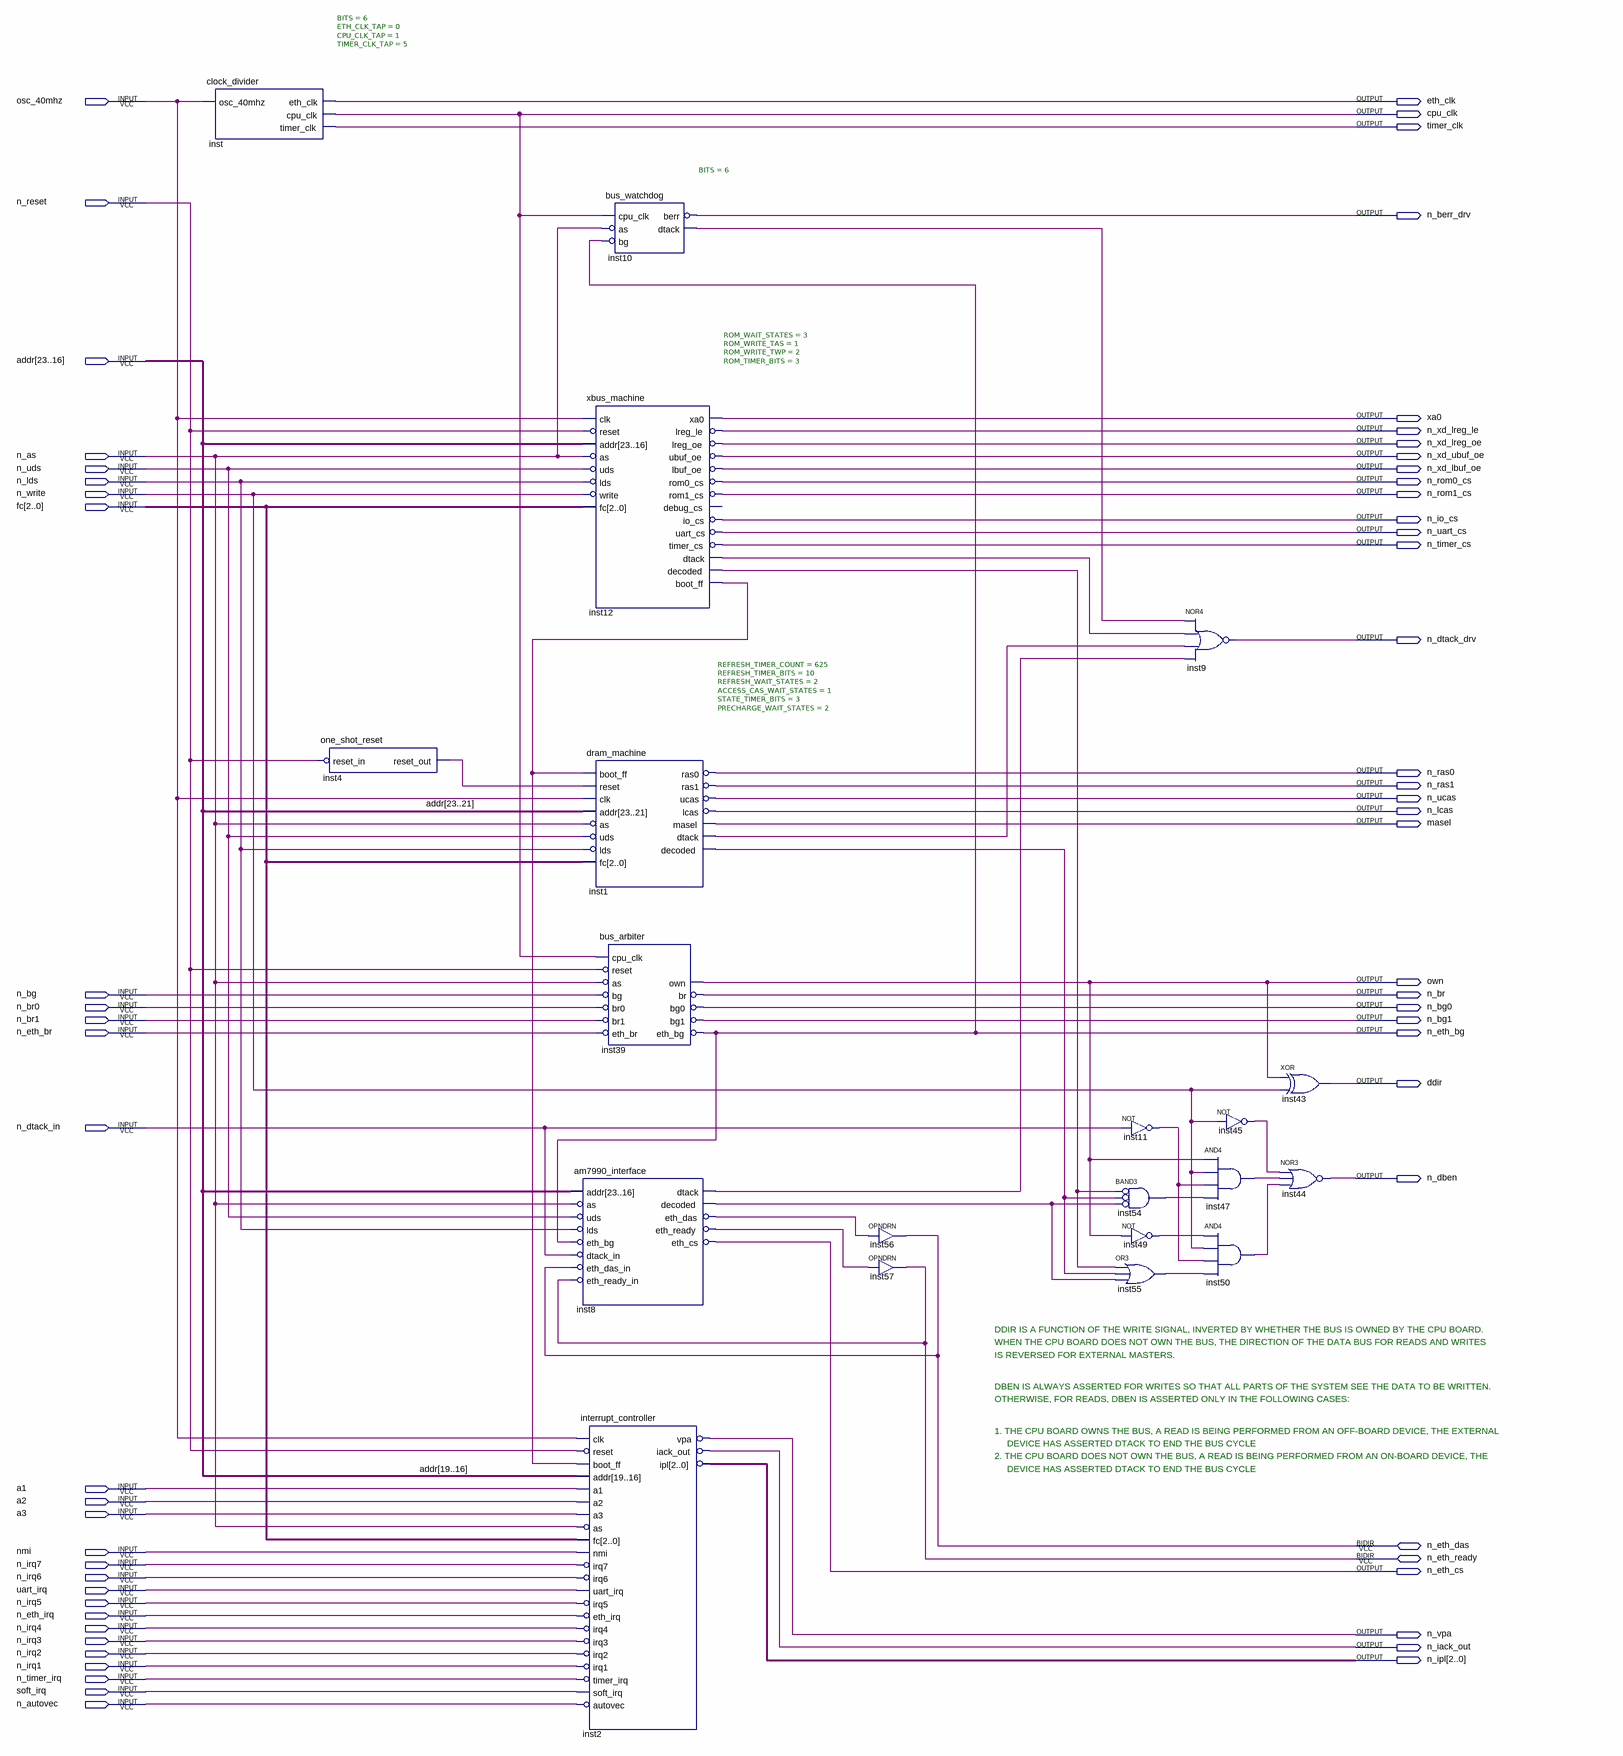
[diagram p0: schematic sheet]
// Quartus schematic COMET68k_CPLD.bdf as structural Verilog: 20 symbols, 62 pins
module COMET68k_CPLD (
  input  osc_40mhz,
  input  n_reset,
  input  [23:16] addr,
  input  n_as,
  input  n_uds,
  input  n_lds,
  input  n_write,
  input  [2:0] fc,
  input  n_bg,
  input  n_br0,
  input  n_br1,
  input  n_eth_br,
  input  n_dtack_in,
  input  a1,
  input  a2,
  input  a3,
  input  nmi,
  input  n_irq7,
  input  n_irq6,
  input  uart_irq,
  input  n_irq5,
  input  n_eth_irq,
  input  n_irq4,
  input  n_irq3,
  input  n_irq2,
  input  n_irq1,
  input  n_timer_irq,
  input  soft_irq,
  input  n_autovec,
  inout  n_eth_das,
  inout  n_eth_ready,
  output eth_clk,
  output cpu_clk,
  output timer_clk,
  output n_berr_drv,
  output xa0,
  output n_xd_lreg_le,
  output n_xd_lreg_oe,
  output n_xd_ubuf_oe,
  output n_xd_lbuf_oe,
  output n_rom0_cs,
  output n_rom1_cs,
  output n_io_cs,
  output n_uart_cs,
  output n_timer_cs,
  output n_dtack_drv,
  output n_ras0,
  output n_ras1,
  output n_ucas,
  output n_lcas,
  output masel,
  output own,
  output n_br,
  output n_bg0,
  output n_bg1,
  output n_eth_bg,
  output ddir,
  output n_dben,
  output n_eth_cs,
  output n_vpa,
  output n_iack_out,
  output [2:0] n_ipl
);

  wire inst1_decoded, inst1_dtack, inst1_lcas, inst1_ras0, inst1_ras1, inst1_ucas, inst2_iack_out, inst2_vpa,
       inst4_reset_out, inst8_decoded, inst8_dtack, inst8_eth_cs, inst8_eth_das, inst8_eth_das_inverted_out,
       inst8_eth_ready, inst8_eth_ready_inverted_out, inst10_berr, inst10_dtack, inst11_out, inst12_boot_ff,
       inst12_decoded, inst12_dtack, inst12_io_cs, inst12_lbuf_oe, inst12_lreg_le, inst12_lreg_oe,
       inst12_rom0_cs, inst12_rom1_cs, inst12_timer_cs, inst12_uart_cs, inst12_ubuf_oe, inst39_bg0,
       inst39_bg1, inst39_br, inst39_eth_bg, inst45_out, inst47_out, inst49_out, inst50_out, inst54_out,
       inst55_out;
  wire [2:0] inst2_ipl;

  clock_divider #(.BITS(6), .ETH_CLK_TAP(0), .CPU_CLK_TAP(1), .TIMER_CLK_TAP(5)) inst (
    .osc_40mhz(osc_40mhz), .eth_clk(eth_clk), .cpu_clk(cpu_clk), .timer_clk(timer_clk));
  one_shot_reset inst4 (.reset_in(~n_reset), .reset_out(inst4_reset_out));
  bus_watchdog #(.BITS(6)) inst10 (
    .cpu_clk(cpu_clk), .as(~n_as), .bg(~n_eth_bg), .berr(inst10_berr), .dtack(inst10_dtack));
  not inst10_berr_inverted (n_berr_drv, inst10_berr);
  xbus_machine #(.ROM_WAIT_STATES(3), .ROM_WRITE_TAS(1), .ROM_WRITE_TWP(2), .ROM_TIMER_BITS(3)) inst12 (
    .clk(osc_40mhz), .reset(~n_reset), .addr(addr), .as(~n_as), .uds(~n_uds), .lds(~n_lds), .write(~n_write),
    .fc(fc), .xa0(xa0), .lreg_le(inst12_lreg_le), .lreg_oe(inst12_lreg_oe), .ubuf_oe(inst12_ubuf_oe),
    .lbuf_oe(inst12_lbuf_oe), .rom0_cs(inst12_rom0_cs), .rom1_cs(inst12_rom1_cs), .io_cs(inst12_io_cs),
    .uart_cs(inst12_uart_cs), .timer_cs(inst12_timer_cs), .dtack(inst12_dtack), .decoded(inst12_decoded),
    .boot_ff(inst12_boot_ff));  // open: debug_cs
  not inst12_lreg_le_inverted (n_xd_lreg_le, inst12_lreg_le);
  not inst12_lreg_oe_inverted (n_xd_lreg_oe, inst12_lreg_oe);
  not inst12_ubuf_oe_inverted (n_xd_ubuf_oe, inst12_ubuf_oe);
  not inst12_lbuf_oe_inverted (n_xd_lbuf_oe, inst12_lbuf_oe);
  not inst12_rom0_cs_inverted (n_rom0_cs, inst12_rom0_cs);
  not inst12_rom1_cs_inverted (n_rom1_cs, inst12_rom1_cs);
  not inst12_io_cs_inverted (n_io_cs, inst12_io_cs);
  not inst12_uart_cs_inverted (n_uart_cs, inst12_uart_cs);
  not inst12_timer_cs_inverted (n_timer_cs, inst12_timer_cs);
  dram_machine #(.REFRESH_TIMER_COUNT(625), .REFRESH_TIMER_BITS(10), .REFRESH_WAIT_STATES(2), .ACCESS_CAS_WAIT_STATES(1), .STATE_TIMER_BITS(3), .PRECHARGE_WAIT_STATES(2)) inst1 (
    .boot_ff(inst12_boot_ff), .reset(inst4_reset_out), .clk(osc_40mhz), .addr(addr[23:21]), .as(~n_as),
    .uds(~n_uds), .lds(~n_lds), .fc(fc), .ras0(inst1_ras0), .ras1(inst1_ras1), .ucas(inst1_ucas),
    .lcas(inst1_lcas), .masel(masel), .dtack(inst1_dtack), .decoded(inst1_decoded));
  not inst1_ras0_inverted (n_ras0, inst1_ras0);
  not inst1_ras1_inverted (n_ras1, inst1_ras1);
  not inst1_ucas_inverted (n_ucas, inst1_ucas);
  not inst1_lcas_inverted (n_lcas, inst1_lcas);
  bus_arbiter inst39 (
    .cpu_clk(cpu_clk), .reset(~n_reset), .as(~n_as), .bg(~n_bg), .br0(~n_br0), .br1(~n_br1),
    .eth_br(~n_eth_br), .own(own), .br(inst39_br), .bg0(inst39_bg0), .bg1(inst39_bg1), .eth_bg(inst39_eth_bg));
  not inst39_br_inverted (n_br, inst39_br);
  not inst39_bg0_inverted (n_bg0, inst39_bg0);
  not inst39_bg1_inverted (n_bg1, inst39_bg1);
  not inst39_eth_bg_inverted (n_eth_bg, inst39_eth_bg);
  am7990_interface inst8 (
    .addr(addr), .as(~n_as), .uds(~n_uds), .lds(~n_lds), .eth_bg(~n_eth_bg), .dtack_in(~n_dtack_in),
    .eth_das_in(~n_eth_das), .eth_ready_in(~n_eth_ready), .dtack(inst8_dtack), .decoded(inst8_decoded),
    .eth_das(inst8_eth_das), .eth_ready(inst8_eth_ready), .eth_cs(inst8_eth_cs));
  not inst8_eth_das_inverted (inst8_eth_das_inverted_out, inst8_eth_das);
  not inst8_eth_ready_inverted (inst8_eth_ready_inverted_out, inst8_eth_ready);
  not inst8_eth_cs_inverted (n_eth_cs, inst8_eth_cs);
  interrupt_controller inst2 (
    .clk(osc_40mhz), .reset(~n_reset), .boot_ff(inst12_boot_ff), .addr(addr[19:16]), .a1(a1), .a2(a2),
    .a3(a3), .as(~n_as), .fc(fc), .nmi(nmi), .irq7(~n_irq7), .irq6(~n_irq6), .uart_irq(uart_irq),
    .irq5(~n_irq5), .eth_irq(~n_eth_irq), .irq4(~n_irq4), .irq3(~n_irq3), .irq2(~n_irq2), .irq1(~n_irq1),
    .timer_irq(~n_timer_irq), .soft_irq(soft_irq), .autovec(~n_autovec), .vpa(inst2_vpa),
    .iack_out(inst2_iack_out), .ipl(inst2_ipl));
  not inst2_vpa_inverted (n_vpa, inst2_vpa);
  not inst2_iack_out_inverted (n_iack_out, inst2_iack_out);
  assign n_ipl = ~inst2_ipl;  // NOT inst2_ipl_inverted, 3 bits wide
  OPNDRN inst56 (.IN(inst8_eth_das_inverted_out), .OUT(n_eth_das));
  OPNDRN inst57 (.IN(inst8_eth_ready_inverted_out), .OUT(n_eth_ready));
  and inst54 (inst54_out, ~inst12_decoded, ~inst1_decoded, ~inst8_decoded);  // BAND3
  or inst55 (inst55_out, inst12_decoded, inst1_decoded, inst8_decoded);
  not inst11 (inst11_out, n_dtack_in);
  not inst49 (inst49_out, own);
  nor inst9 (n_dtack_drv, inst10_dtack, inst12_dtack, inst1_dtack, inst8_dtack);
  not inst45 (inst45_out, n_write);
  and inst47 (inst47_out, own, n_write, inst11_out, inst54_out);
  and inst50 (inst50_out, inst49_out, n_write, inst11_out, inst55_out);
  xor inst43 (ddir, own, n_write);
  nor inst44 (n_dben, inst45_out, inst47_out, inst50_out);

  // Notes on the sheet:
  //   DDIR IS A FUNCTION OF THE WRITE SIGNAL, INVERTED BY WHETHER THE BUS IS OWNED BY THE CPU BOARD.
  //   WHEN THE CPU BOARD DOES NOT OWN THE BUS, THE DIRECTION OF THE DATA BUS FOR READS AND WRITES
  //   IS REVERSED FOR EXTERNAL MASTERS.
  //   DBEN IS ALWAYS ASSERTED FOR WRITES SO THAT ALL PARTS OF THE SYSTEM SEE THE DATA TO BE WRITTEN.
  //   OTHERWISE, FOR READS, DBEN IS ASSERTED ONLY IN THE FOLLOWING CASES:
  //   1. THE CPU BOARD OWNS THE BUS, A READ IS BEING PERFORMED FROM AN OFF-BOARD DEVICE, THE EXTERNAL
  //   DEVICE HAS ASSERTED DTACK TO END THE BUS CYCLE
  //   2. THE CPU BOARD DOES NOT OWN THE BUS, A READ IS BEING PERFORMED FROM AN ON-BOARD DEVICE, THE
  //   DEVICE HAS ASSERTED DTACK TO END THE BUS CYCLE
endmodule
